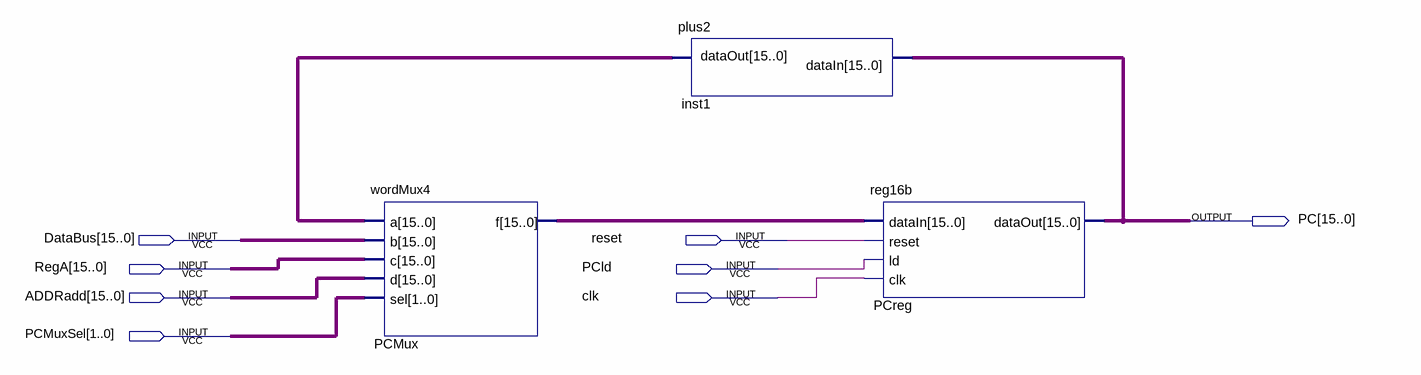
[diagram p0: schematic sheet]
// Quartus schematic PCstruct.bdf as structural Verilog: 3 symbols, 8 pins
module PCstruct (
  input  [15:0] DataBus,
  input  reset,
  input  [15:0] RegA,
  input  PCld,
  input  [15:0] ADDRadd,
  input  clk,
  input  [1:0] PCMuxSel,
  output [15:0] PC
);

  wire [15:0] inst1_dataout, PCMux_f;

  wordMux4 PCMux (.a(inst1_dataout), .b(DataBus), .c(RegA), .d(ADDRadd), .sel(PCMuxSel), .f(PCMux_f));
  plus2 inst1 (.dataIn(PC), .dataOut(inst1_dataout));
  reg16b PCreg (.dataIn(PCMux_f), .reset(reset), .ld(PCld), .clk(clk), .dataOut(PC));
endmodule
